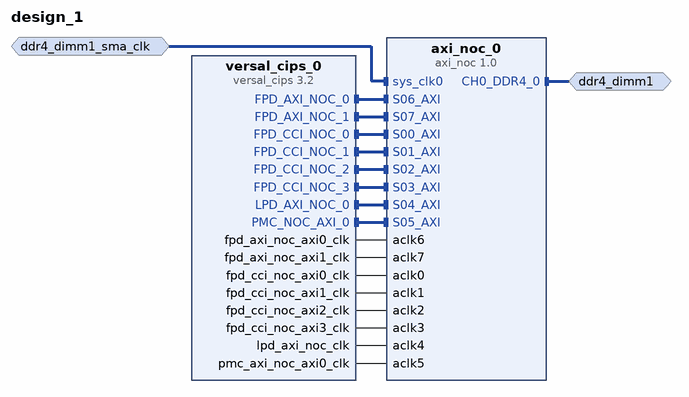
[diagram p0: block diagram of the top level]
# Vivado block design design_1, xcvc1902-vsva2197-2MP-e-S, Vivado 2022.1
create_bd_design design_1

create_bd_intf_port -mode Master -vlnv xilinx.com:interface:ddr4_rtl:1.0 ddr4_dimm1
create_bd_intf_port -mode Slave -vlnv xilinx.com:interface:diff_clock_rtl:1.0 ddr4_dimm1_sma_clk
set_property -dict {CONFIG.FREQ_HZ 200000000} [get_bd_intf_ports ddr4_dimm1_sma_clk]

create_bd_cell -type ip -vlnv xilinx.com:ip:versal_cips:3.2 versal_cips_0
set_property -dict [list \
  CONFIG.DDR_MEMORY_MODE Enable \
  CONFIG.DEBUG_MODE JTAG \
  CONFIG.DESIGN_MODE 1 \
  CONFIG.PS_BOARD_INTERFACE ps_pmc_fixed_io \
  CONFIG.PS_PMC_CONFIG {DDR_MEMORY_MODE {Connectivity to DDR via NOC} DEBUG_MODE JTAG DESIGN_MODE 1 PMC_GPIO0_MIO_PERIPHERAL {{ENABLE 1} {IO {PMC_MIO 0 .. 25}}} PMC_GPIO1_MIO_PERIPHERAL {{ENABLE 1} {IO {PMC_MIO 26 .. 51}}} PMC_MIO37 {{AUX_IO 0} {DIRECTION out} {DRIVE_STRENGTH 8mA} {OUTPUT_DATA high} {PULL pullup} {SCHMITT 0} {SLEW slow} {USAGE GPIO}} PMC_OSPI_PERIPHERAL {{ENABLE 0} {IO {PMC_MIO 0 .. 11}} {MODE Single}} PMC_QSPI_COHERENCY 0 PMC_QSPI_FBCLK {{ENABLE 1} {IO {PMC_MIO 6}}} PMC_QSPI_PERIPHERAL_DATA_MODE x4 PMC_QSPI_PERIPHERAL_ENABLE 1 PMC_QSPI_PERIPHERAL_MODE {Dual Parallel} PMC_REF_CLK_FREQMHZ 33.3333 PMC_SD1 {{CD_ENABLE 1} {CD_IO {PMC_MIO 28}} {POW_ENABLE 1} {POW_IO {PMC_MIO 51}} {RESET_ENABLE 0} {RESET_IO {PMC_MIO 12}} {WP_ENABLE 0} {WP_IO {PMC_MIO 1}}} PMC_SD1_COHERENCY 0 PMC_SD1_DATA_TRANSFER_MODE 8Bit PMC_SD1_PERIPHERAL {{CLK_100_SDR_OTAP_DLY 0x3} {CLK_200_SDR_OTAP_DLY 0x2} {CLK_50_DDR_ITAP_DLY 0x36} {CLK_50_DDR_OTAP_DLY 0x3} {CLK_50_SDR_ITAP_DLY 0x2C} {CLK_50_SDR_OTAP_DLY 0x4} {ENABLE 1} {IO {PMC_MIO 26 .. 36}}} PMC_SD1_SLOT_TYPE {SD 3.0} PMC_USE_PMC_NOC_AXI0 1 PS_BOARD_INTERFACE ps_pmc_fixed_io PS_CAN1_PERIPHERAL {{ENABLE 1} {IO {PMC_MIO 40 .. 41}}} PS_ENET0_MDIO {{ENABLE 1} {IO {PS_MIO 24 .. 25}}} PS_ENET0_PERIPHERAL {{ENABLE 1} {IO {PS_MIO 0 .. 11}}} PS_ENET1_PERIPHERAL {{ENABLE 1} {IO {PS_MIO 12 .. 23}}} PS_GEN_IPI0_ENABLE 1 PS_GEN_IPI0_MASTER A72 PS_GEN_IPI1_ENABLE 1 PS_GEN_IPI1_MASTER R5_0 PS_GEN_IPI2_ENABLE 1 PS_GEN_IPI2_MASTER R5_0 PS_GEN_IPI3_ENABLE 1 PS_GEN_IPI3_MASTER A72 PS_GEN_IPI4_ENABLE 1 PS_GEN_IPI5_ENABLE 1 PS_GEN_IPI6_ENABLE 1 PS_HSDP_EGRESS_TRAFFIC JTAG PS_HSDP_INGRESS_TRAFFIC JTAG PS_HSDP_MODE None PS_I2C0_PERIPHERAL {{ENABLE 1} {IO {PMC_MIO 46 .. 47}}} PS_I2C1_PERIPHERAL {{ENABLE 1} {IO {PMC_MIO 44 .. 45}}} PS_MIO19 {{AUX_IO 0} {DIRECTION in} {DRIVE_STRENGTH 8mA} {OUTPUT_DATA default} {PULL disable} {SCHMITT 0} {SLEW slow} {USAGE Reserved}} PS_MIO21 {{AUX_IO 0} {DIRECTION in} {DRIVE_STRENGTH 8mA} {OUTPUT_DATA default} {PULL disable} {SCHMITT 0} {SLEW slow} {USAGE Reserved}} PS_MIO7 {{AUX_IO 0} {DIRECTION in} {DRIVE_STRENGTH 8mA} {OUTPUT_DATA default} {PULL disable} {SCHMITT 0} {SLEW slow} {USAGE Reserved}} PS_MIO9 {{AUX_IO 0} {DIRECTION in} {DRIVE_STRENGTH 8mA} {OUTPUT_DATA default} {PULL disable} {SCHMITT 0} {SLEW slow} {USAGE Reserved}} PS_NUM_FABRIC_RESETS 0 PS_PCIE_RESET {{ENABLE 1}} PS_UART0_PERIPHERAL {{ENABLE 1} {IO {PMC_MIO 42 .. 43}}} PS_USB3_PERIPHERAL {{ENABLE 1} {IO {PMC_MIO 13 .. 25}}} PS_USE_FPD_AXI_NOC0 1 PS_USE_FPD_AXI_NOC1 1 PS_USE_FPD_CCI_NOC 1 PS_USE_FPD_CCI_NOC0 1 PS_USE_NOC_LPD_AXI0 1 PS_USE_PMCPL_CLK0 0 PS_USE_PMCPL_CLK1 0 PS_USE_PMCPL_CLK2 0 PS_USE_PMCPL_CLK3 0 SMON_ALARMS Set_Alarms_On SMON_ENABLE_TEMP_AVERAGING 0 SMON_TEMP_AVERAGING_SAMPLES 0 } \
  CONFIG.PS_PMC_CONFIG_APPLIED 1 \
] [get_bd_cells versal_cips_0]
create_bd_cell -type ip -vlnv xilinx.com:ip:axi_noc:1.0 axi_noc_0
set_property -dict [list \
  CONFIG.CH0_DDR4_0_BOARD_INTERFACE ddr4_dimm1 \
  CONFIG.MC_CHAN_REGION1 DDR_LOW1 \
  CONFIG.MC_EN_INTR_RESP TRUE \
  CONFIG.MC_SYSTEM_CLOCK Differential \
  CONFIG.NUM_CLKS 8 \
  CONFIG.NUM_MC 1 \
  CONFIG.NUM_MCP 4 \
  CONFIG.NUM_MI 0 \
  CONFIG.NUM_SI 8 \
  CONFIG.sys_clk0_BOARD_INTERFACE ddr4_dimm1_sma_clk \
] [get_bd_cells axi_noc_0]

# ---- connections ----

connect_bd_intf_net [get_bd_intf_ports ddr4_dimm1] [get_bd_intf_pins axi_noc_0/CH0_DDR4_0]
connect_bd_intf_net [get_bd_intf_ports ddr4_dimm1_sma_clk] [get_bd_intf_pins axi_noc_0/sys_clk0]
connect_bd_intf_net [get_bd_intf_pins versal_cips_0/FPD_AXI_NOC_0] [get_bd_intf_pins axi_noc_0/S06_AXI]
connect_bd_intf_net [get_bd_intf_pins versal_cips_0/FPD_AXI_NOC_1] [get_bd_intf_pins axi_noc_0/S07_AXI]
connect_bd_intf_net [get_bd_intf_pins versal_cips_0/FPD_CCI_NOC_0] [get_bd_intf_pins axi_noc_0/S00_AXI]
connect_bd_intf_net [get_bd_intf_pins versal_cips_0/FPD_CCI_NOC_1] [get_bd_intf_pins axi_noc_0/S01_AXI]
connect_bd_intf_net [get_bd_intf_pins versal_cips_0/FPD_CCI_NOC_2] [get_bd_intf_pins axi_noc_0/S02_AXI]
connect_bd_intf_net [get_bd_intf_pins versal_cips_0/FPD_CCI_NOC_3] [get_bd_intf_pins axi_noc_0/S03_AXI]
connect_bd_intf_net [get_bd_intf_pins versal_cips_0/LPD_AXI_NOC_0] [get_bd_intf_pins axi_noc_0/S04_AXI]
connect_bd_intf_net [get_bd_intf_pins versal_cips_0/PMC_NOC_AXI_0] [get_bd_intf_pins axi_noc_0/S05_AXI]
connect_bd_net [get_bd_pins versal_cips_0/fpd_axi_noc_axi0_clk] [get_bd_pins axi_noc_0/aclk6]
connect_bd_net [get_bd_pins versal_cips_0/fpd_axi_noc_axi1_clk] [get_bd_pins axi_noc_0/aclk7]
connect_bd_net [get_bd_pins versal_cips_0/fpd_cci_noc_axi0_clk] [get_bd_pins axi_noc_0/aclk0]
connect_bd_net [get_bd_pins versal_cips_0/fpd_cci_noc_axi1_clk] [get_bd_pins axi_noc_0/aclk1]
connect_bd_net [get_bd_pins versal_cips_0/fpd_cci_noc_axi2_clk] [get_bd_pins axi_noc_0/aclk2]
connect_bd_net [get_bd_pins versal_cips_0/fpd_cci_noc_axi3_clk] [get_bd_pins axi_noc_0/aclk3]
connect_bd_net [get_bd_pins versal_cips_0/lpd_axi_noc_clk] [get_bd_pins axi_noc_0/aclk4]
connect_bd_net [get_bd_pins versal_cips_0/pmc_axi_noc_axi0_clk] [get_bd_pins axi_noc_0/aclk5]

# ---- address map ----
assign_bd_address -offset 0x0000000000000000 -range 2G -target_address_space [get_bd_addr_spaces versal_cips_0/FPD_AXI_NOC_0] [get_bd_addr_segs axi_noc_0/S06_AXI/C2_DDR_LOW0]
assign_bd_address -offset 0x0000000800000000 -range 6G -target_address_space [get_bd_addr_spaces versal_cips_0/FPD_AXI_NOC_0] [get_bd_addr_segs axi_noc_0/S06_AXI/C2_DDR_LOW1]
assign_bd_address -offset 0x0000000000000000 -range 2G -target_address_space [get_bd_addr_spaces versal_cips_0/FPD_AXI_NOC_1] [get_bd_addr_segs axi_noc_0/S07_AXI/C3_DDR_LOW0]
assign_bd_address -offset 0x0000000800000000 -range 6G -target_address_space [get_bd_addr_spaces versal_cips_0/FPD_AXI_NOC_1] [get_bd_addr_segs axi_noc_0/S07_AXI/C3_DDR_LOW1]
assign_bd_address -offset 0x0000000000000000 -range 2G -target_address_space [get_bd_addr_spaces versal_cips_0/FPD_CCI_NOC_0] [get_bd_addr_segs axi_noc_0/S00_AXI/C0_DDR_LOW0]
assign_bd_address -offset 0x0000000800000000 -range 6G -target_address_space [get_bd_addr_spaces versal_cips_0/FPD_CCI_NOC_0] [get_bd_addr_segs axi_noc_0/S00_AXI/C0_DDR_LOW1]
assign_bd_address -offset 0x0000000000000000 -range 2G -target_address_space [get_bd_addr_spaces versal_cips_0/FPD_CCI_NOC_1] [get_bd_addr_segs axi_noc_0/S01_AXI/C1_DDR_LOW0]
assign_bd_address -offset 0x0000000800000000 -range 6G -target_address_space [get_bd_addr_spaces versal_cips_0/FPD_CCI_NOC_1] [get_bd_addr_segs axi_noc_0/S01_AXI/C1_DDR_LOW1]
assign_bd_address -offset 0x0000000000000000 -range 2G -target_address_space [get_bd_addr_spaces versal_cips_0/FPD_CCI_NOC_2] [get_bd_addr_segs axi_noc_0/S02_AXI/C2_DDR_LOW0]
assign_bd_address -offset 0x0000000800000000 -range 6G -target_address_space [get_bd_addr_spaces versal_cips_0/FPD_CCI_NOC_2] [get_bd_addr_segs axi_noc_0/S02_AXI/C2_DDR_LOW1]
assign_bd_address -offset 0x0000000000000000 -range 2G -target_address_space [get_bd_addr_spaces versal_cips_0/FPD_CCI_NOC_3] [get_bd_addr_segs axi_noc_0/S03_AXI/C3_DDR_LOW0]
assign_bd_address -offset 0x0000000800000000 -range 6G -target_address_space [get_bd_addr_spaces versal_cips_0/FPD_CCI_NOC_3] [get_bd_addr_segs axi_noc_0/S03_AXI/C3_DDR_LOW1]
assign_bd_address -offset 0x0000000000000000 -range 2G -target_address_space [get_bd_addr_spaces versal_cips_0/LPD_AXI_NOC_0] [get_bd_addr_segs axi_noc_0/S04_AXI/C0_DDR_LOW0]
assign_bd_address -offset 0x0000000800000000 -range 6G -target_address_space [get_bd_addr_spaces versal_cips_0/LPD_AXI_NOC_0] [get_bd_addr_segs axi_noc_0/S04_AXI/C0_DDR_LOW1]
assign_bd_address -offset 0x0000000000000000 -range 2G -target_address_space [get_bd_addr_spaces versal_cips_0/PMC_NOC_AXI_0] [get_bd_addr_segs axi_noc_0/S05_AXI/C1_DDR_LOW0]
assign_bd_address -offset 0x0000000800000000 -range 6G -target_address_space [get_bd_addr_spaces versal_cips_0/PMC_NOC_AXI_0] [get_bd_addr_segs axi_noc_0/S05_AXI/C1_DDR_LOW1]

validate_bd_design
save_bd_design
